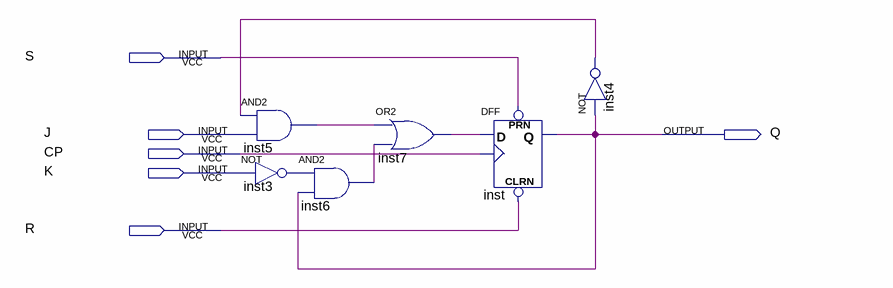
[diagram p0: schematic sheet]
// Quartus schematic lab5.bdf as structural Verilog: 6 symbols, 6 pins
module lab5 (
  input  S,
  input  J,
  input  CP,
  input  K,
  input  R,
  output Q
);

  wire inst3_out, inst4_out, inst5_out, inst6_out, inst7_out;

  and inst5 (inst5_out, inst4_out, J);
  not inst3 (inst3_out, K);
  and inst6 (inst6_out, inst3_out, Q);
  or inst7 (inst7_out, inst5_out, inst6_out);
  DFF inst (.CLRN(R), .CLK(CP), .D(inst7_out), .PRN(S), .Q(Q));
  not inst4 (inst4_out, Q);
endmodule
